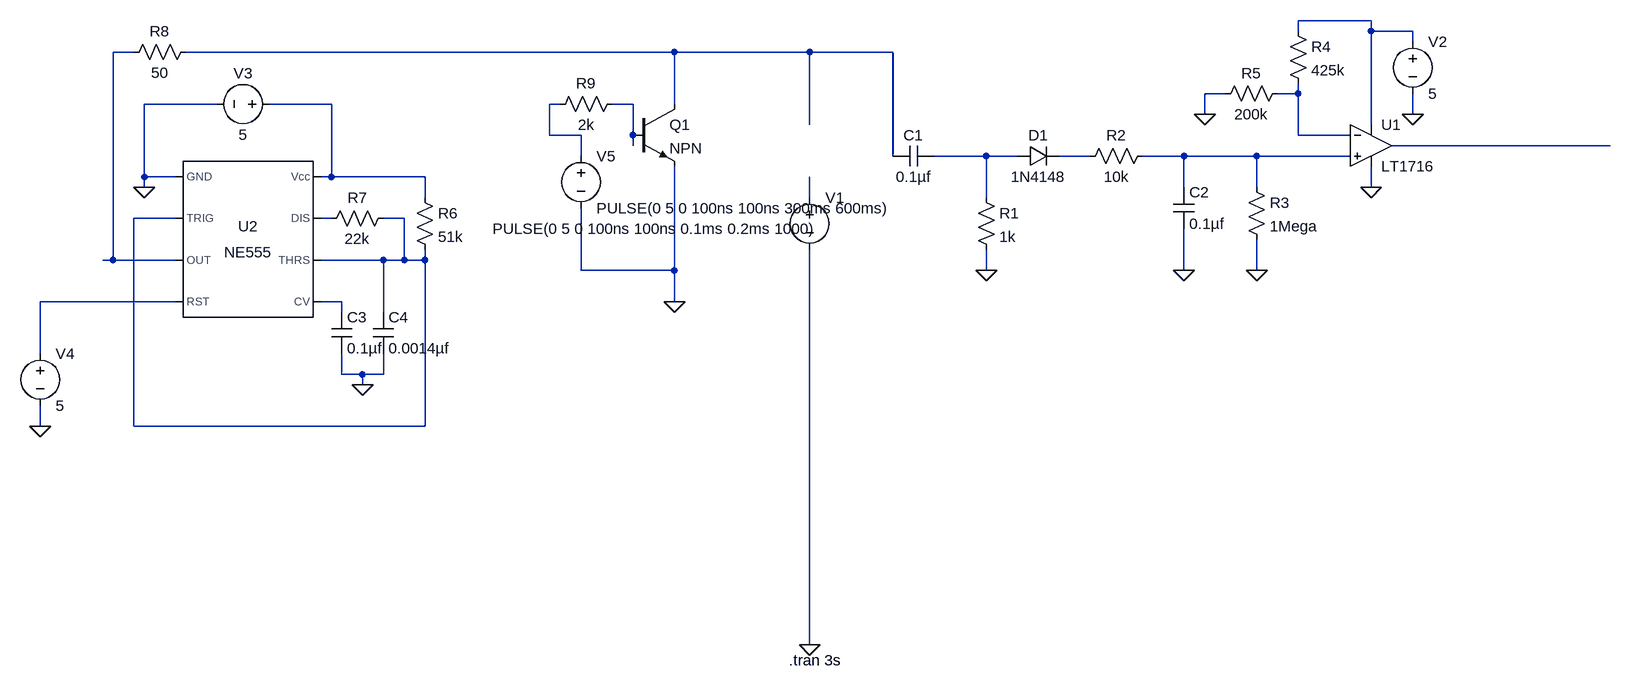
[diagram p0: schematic Short_Detector.asc]
Short_Detector.asc, the LTspice schematic file:
Version 4
SHEET 1 1284 888
WIRE 912 -112 800 -112
WIRE 800 -96 800 -112
WIRE 912 -96 912 -112
WIRE 976 -96 912 -96
WIRE 976 -80 976 -96
WIRE -992 -64 -1024 -64
WIRE -160 -64 -912 -64
WIRE 48 -64 -160 -64
WIRE 176 -64 48 -64
WIRE 688 0 656 0
WIRE 800 0 800 -16
WIRE 800 0 768 0
WIRE -864 16 -976 16
WIRE -688 16 -784 16
WIRE -336 16 -352 16
WIRE -224 16 -256 16
WIRE -160 16 -160 -64
WIRE 656 32 656 0
WIRE 976 32 976 0
WIRE 48 48 48 -64
WIRE 912 48 912 -96
WIRE -352 64 -352 16
WIRE -304 64 -352 64
WIRE -224 64 -224 16
WIRE 800 64 800 0
WIRE 880 64 800 64
WIRE -224 80 -224 64
WIRE 1280 80 944 80
WIRE -304 96 -304 64
WIRE 176 96 176 -64
WIRE 320 96 240 96
WIRE 368 96 320 96
WIRE 480 96 432 96
WIRE 624 96 560 96
WIRE 736 96 624 96
WIRE 880 96 736 96
WIRE -976 128 -976 16
WIRE -928 128 -976 128
WIRE -688 128 -688 16
WIRE -688 128 -704 128
WIRE -544 128 -688 128
WIRE -976 144 -976 128
WIRE 624 144 624 96
WIRE 736 144 736 96
WIRE 912 144 912 112
WIRE -544 160 -544 128
WIRE 48 160 48 128
WIRE 320 160 320 96
WIRE -928 192 -992 192
WIRE -688 192 -704 192
WIRE -576 192 -608 192
WIRE -1024 256 -1024 -64
WIRE -1024 256 -1040 256
WIRE -928 256 -1024 256
WIRE -608 256 -704 256
WIRE -576 256 -576 192
WIRE -576 256 -608 256
WIRE -544 256 -544 240
WIRE -544 256 -576 256
WIRE -304 272 -304 176
WIRE -160 272 -160 112
WIRE -160 272 -304 272
WIRE 320 272 320 240
WIRE 624 272 624 208
WIRE 736 272 736 224
WIRE -928 320 -1136 320
WIRE -672 320 -704 320
WIRE -160 320 -160 272
WIRE -672 336 -672 320
WIRE -608 336 -608 256
WIRE -1136 400 -1136 320
WIRE -672 432 -672 400
WIRE -640 432 -672 432
WIRE -608 432 -608 400
WIRE -608 432 -640 432
WIRE -640 448 -640 432
WIRE -1136 512 -1136 480
WIRE -992 512 -992 192
WIRE -544 512 -544 256
WIRE -544 512 -992 512
WIRE 48 848 48 240
FLAG 48 848 0
FLAG 624 272 0
FLAG 736 272 0
FLAG 912 144 0
FLAG 976 32 0
FLAG 656 32 0
FLAG -976 144 0
FLAG -640 448 0
FLAG 320 272 0
FLAG -1136 512 0
FLAG -160 320 0
SYMBOL cap 240 80 R90
WINDOW 0 0 32 VBottom 2
WINDOW 3 32 32 VTop 2
SYMATTR InstName C1
SYMATTR Value 0.1µf
SYMBOL voltage 48 144 R0
WINDOW 123 0 0 Left 0
WINDOW 39 0 0 Left 0
WINDOW 3 -488 64 Left 2
SYMATTR Value PULSE(0 5 0 100ns 100ns 0.1ms 0.2ms 1000)
SYMATTR InstName V1
SYMBOL res 304 144 R0
SYMATTR InstName R1
SYMATTR Value 1k
SYMBOL diode 368 112 R270
WINDOW 0 32 32 VTop 2
WINDOW 3 0 32 VBottom 2
SYMATTR InstName D1
SYMATTR Value 1N4148
SYMBOL res 576 80 R90
WINDOW 0 0 56 VBottom 2
WINDOW 3 32 56 VTop 2
SYMATTR InstName R2
SYMATTR Value 10k
SYMBOL cap 608 144 R0
SYMATTR InstName C2
SYMATTR Value 0.1µf
SYMBOL res 720 128 R0
SYMATTR InstName R3
SYMATTR Value 1Mega
SYMBOL Comparators\\LT1716 912 80 R0
SYMATTR InstName U1
SYMBOL voltage 976 -96 R0
WINDOW 123 0 0 Left 0
WINDOW 39 0 0 Left 0
SYMATTR InstName V2
SYMATTR Value 5
SYMBOL res 784 -112 R0
SYMATTR InstName R4
SYMATTR Value 425k
SYMBOL res 784 -16 R90
WINDOW 0 0 56 VBottom 2
WINDOW 3 32 56 VTop 2
SYMATTR InstName R5
SYMATTR Value 200k
SYMBOL Misc\\NE555 -816 224 R0
SYMATTR InstName U2
SYMBOL voltage -768 16 R90
WINDOW 0 -32 56 VBottom 2
WINDOW 3 32 56 VTop 2
WINDOW 123 0 0 Left 0
WINDOW 39 0 0 Left 0
SYMATTR InstName V3
SYMATTR Value 5
SYMBOL res -560 144 R0
SYMATTR InstName R6
SYMATTR Value 51k
SYMBOL cap -688 336 R0
SYMATTR InstName C3
SYMATTR Value 0.1µf
SYMBOL cap -624 336 R0
SYMATTR InstName C4
SYMATTR Value 0.0014µf
SYMBOL res -592 176 R90
WINDOW 0 0 56 VBottom 2
WINDOW 3 32 56 VTop 2
SYMATTR InstName R7
SYMATTR Value 22k
SYMBOL voltage -1136 384 R0
WINDOW 123 0 0 Left 0
WINDOW 39 0 0 Left 0
SYMATTR InstName V4
SYMATTR Value 5
SYMBOL res -896 -80 R90
WINDOW 0 0 56 VBottom 2
WINDOW 3 32 56 VTop 2
SYMATTR InstName R8
SYMATTR Value 50
SYMBOL npn -224 16 R0
SYMATTR InstName Q1
SYMBOL voltage -304 80 R0
WINDOW 123 0 0 Left 0
WINDOW 39 0 0 Left 0
SYMATTR InstName V5
SYMATTR Value PULSE(0 5 0 100ns 100ns 300ms 600ms)
SYMBOL res -240 0 R90
WINDOW 0 0 56 VBottom 2
WINDOW 3 32 56 VTop 2
SYMATTR InstName R9
SYMATTR Value 2k
TEXT 16 872 Left 2 !.tran 3s

The netlist it stands for:
* Short_Detector.asc
C1 N009 N003 0.1µf
V1 N012 0 PULSE(0 5 0 100ns 100ns 0.1ms 0.2ms 1000)
R1 N009 0 1k
D1 N009 N010 1N4148
R2 N011 N010 10k
C2 N011 0 0.1µf
R3 N011 0 1Mega
XU1 N011 N004 N001 0 N008 LT1716  ; pins In+ In- V+ V- OUT
V2 N001 0 5
R4 N001 N004 425k
R5 N004 0 200k
XU2 0 N013 N002 N015 N016 N013 N014 N005 NE555  ; pins GND TRIG OUT RST CV THRS DIS Vcc
V3 N005 0 5
R6 N005 N013 51k
C3 N016 0 0.1µf
C4 N013 0 0.0014µf
R7 N013 N014 22k
V4 N015 0 5
R8 N003 N002 50
Q1 N003 N007 0 0 NPN
V5 N006 0 PULSE(0 5 0 100ns 100ns 300ms 600ms)
R9 N007 N006 2k
.model D D
.lib standard.dio
.model NPN NPN
.model PNP PNP
.lib standard.bjt
.tran 3s
.lib LTC1.lib
.lib NE555.sub
.backanno
.end